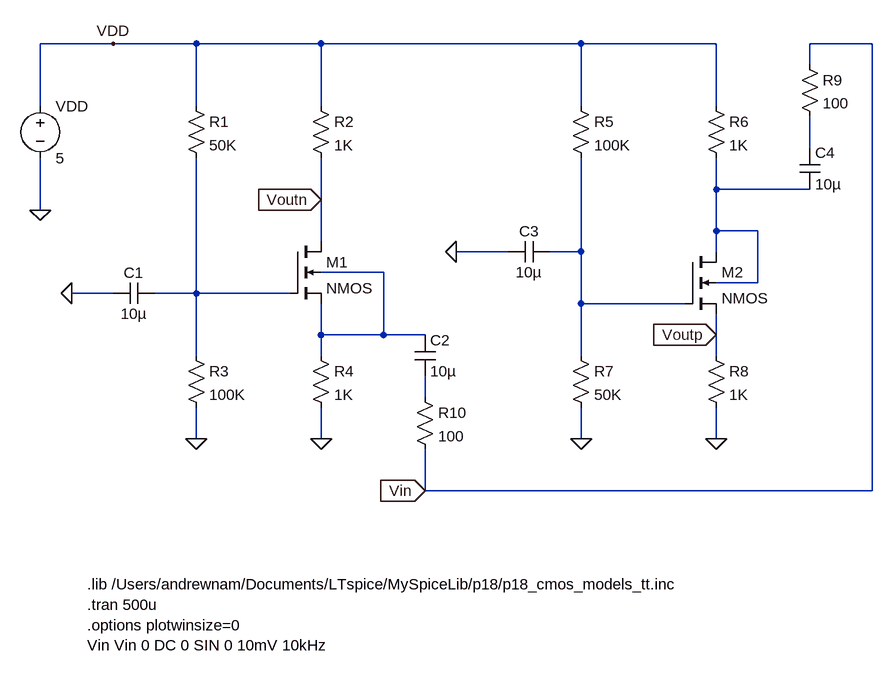
[diagram p0: schematic common_gate_amplifier.asc]
common_gate_amplifier.asc, the LTspice schematic file:
Version 4
SHEET 1 1236 752
WIRE 64 -160 -48 -160
WIRE 192 -160 64 -160
WIRE 384 -160 192 -160
WIRE 784 -160 384 -160
WIRE 992 -160 784 -160
WIRE 1232 -160 1136 -160
WIRE 1136 -128 1136 -160
WIRE -48 -64 -48 -160
WIRE 192 -64 192 -160
WIRE 384 -64 384 -160
WIRE 784 -64 784 -160
WIRE 992 -64 992 -160
WIRE 1136 0 1136 -48
WIRE 992 64 992 16
WIRE 1136 64 992 64
WIRE 384 80 384 16
WIRE -48 96 -48 16
WIRE 992 128 992 64
WIRE 1056 128 992 128
WIRE 384 144 384 80
WIRE 672 160 592 160
WIRE 784 160 784 16
WIRE 784 160 736 160
WIRE 992 160 992 128
WIRE 480 192 384 192
WIRE 1056 208 1056 128
WIRE 1056 208 992 208
WIRE 64 224 0 224
WIRE 192 224 192 16
WIRE 192 224 128 224
WIRE 336 224 192 224
WIRE 784 240 784 160
WIRE 944 240 784 240
WIRE 384 288 384 240
WIRE 480 288 480 192
WIRE 480 288 384 288
WIRE 544 288 480 288
WIRE 992 288 992 256
WIRE 192 320 192 224
WIRE 384 320 384 288
WIRE 784 320 784 240
WIRE 992 320 992 288
WIRE 544 384 544 352
WIRE 192 448 192 400
WIRE 384 448 384 400
WIRE 784 448 784 400
WIRE 992 448 992 400
WIRE 544 528 544 464
WIRE 1232 528 1232 -160
WIRE 1232 528 544 528
FLAG 192 448 0
FLAG 384 448 0
FLAG 784 448 0
FLAG 992 448 0
FLAG -48 96 0
FLAG 592 160 0
FLAG 0 224 0
FLAG 64 -160 VDD
FLAG 544 528 Vin
IOPIN 544 528 In
FLAG 992 288 Voutp
IOPIN 992 288 In
FLAG 384 80 Voutn
IOPIN 384 80 In
SYMBOL voltage -48 -80 R0
SYMATTR InstName VDD
SYMATTR Value 5
SYMBOL res 176 -80 R0
SYMATTR InstName R1
SYMATTR Value 50K
SYMBOL res 368 -80 R0
SYMATTR InstName R2
SYMATTR Value 1K
SYMBOL res 176 304 R0
SYMATTR InstName R3
SYMATTR Value 100K
SYMBOL res 368 304 R0
SYMATTR InstName R4
SYMATTR Value 1K
SYMBOL res 768 -80 R0
SYMATTR InstName R5
SYMATTR Value 100K
SYMBOL res 976 -80 R0
SYMATTR InstName R6
SYMATTR Value 1K
SYMBOL res 768 304 R0
SYMATTR InstName R7
SYMATTR Value 50K
SYMBOL res 976 304 R0
SYMATTR InstName R8
SYMATTR Value 1K
SYMBOL res 1120 -144 R0
SYMATTR InstName R9
SYMATTR Value 100
SYMBOL res 528 368 R0
SYMATTR InstName R10
SYMATTR Value 100
SYMBOL nmos4 336 144 R0
SYMATTR InstName M1
SYMATTR Value2 l=0.18u w=10u
SYMBOL nmos4 944 160 R0
SYMATTR InstName M2
SYMATTR Value2 l=0.18u w=10u
SYMBOL cap 128 208 R90
WINDOW 0 0 32 VBottom 2
WINDOW 3 32 32 VTop 2
SYMATTR InstName C1
SYMATTR Value 10µ
SYMBOL cap 528 288 R0
SYMATTR InstName C2
SYMATTR Value 10µ
SYMBOL cap 672 176 R270
WINDOW 0 32 32 VTop 2
WINDOW 3 0 32 VBottom 2
SYMATTR InstName C3
SYMATTR Value 10µ
SYMBOL cap 1120 0 R0
SYMATTR InstName C4
SYMATTR Value 10µ
TEXT 24 672 Left 2 !.lib /Users/andrewnam/Documents/LTspice/MySpiceLib/p18/p18_cmos_models_tt.inc\n.tran 500u\n.options plotwinsize=0\nVin Vin 0 DC 0 SIN 0 10mV 10kHz

The netlist it stands for:
* common_gate_amplifier.asc
VDD VDD 0 5
R1 VDD N005 50K
R2 VDD Voutn 1K
R3 N005 0 100K
R4 N004 0 1K
R5 VDD N003 100K
R6 VDD N002 1K
R7 N003 0 50K
R8 Voutp 0 1K
R9 Vin N001 100
R10 N006 Vin 100
M1 Voutn N005 N004 N004 NMOS l=0.18u w=10u
M2 N002 N003 Voutp N002 NMOS l=0.18u w=10u
C1 N005 0 10µ
C2 N004 N006 10µ
C3 0 N003 10µ
C4 N001 N002 10µ
.model NMOS NMOS
.model PMOS PMOS
.lib standard.mos
.lib /Users/andrewnam/Documents/LTspice/MySpiceLib/p18/p18_cmos_models_tt.inc
.tran 500u
.options plotwinsize=0
Vin Vin 0 DC 0 SIN 0 10mV 10kHz
.backanno
.end